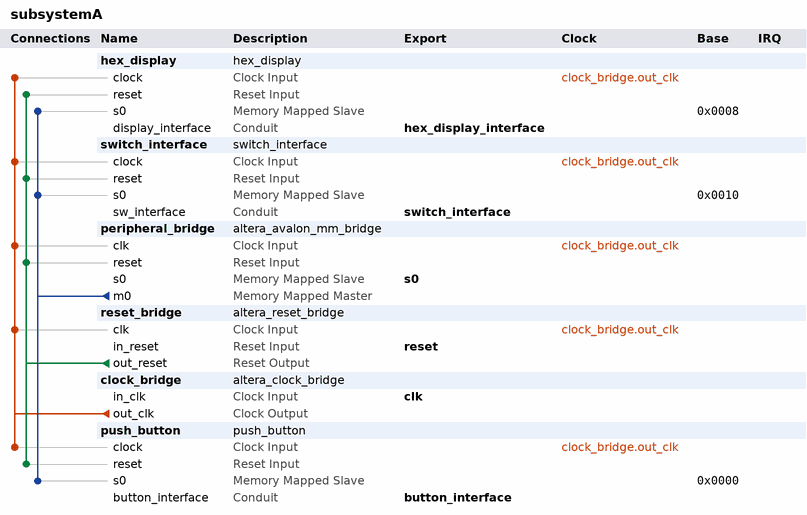
[diagram p0: system contents]
# Platform Designer (Qsys) system subsystemA, MAX 10 10M50DAF484C7G
# Parameters at their usual value, and those the tool derives, are not listed.
package require -exact qsys 18.1
create_system subsystemA
set_project_property DEVICE_FAMILY {MAX 10}
set_project_property DEVICE 10M50DAF484C7G

add_instance hex_display hex_display 1.0

add_instance switch_interface switch_interface 1.0

add_instance peripheral_bridge altera_avalon_mm_bridge 18.1
set_instance_parameter_value peripheral_bridge ADDRESS_UNITS SYMBOLS
set_instance_parameter_value peripheral_bridge ADDRESS_WIDTH 10
set_instance_parameter_value peripheral_bridge DATA_WIDTH 32
set_instance_parameter_value peripheral_bridge MAX_PENDING_RESPONSES 4
set_instance_parameter_value peripheral_bridge USE_AUTO_ADDRESS_WIDTH 0

add_instance reset_bridge altera_reset_bridge 18.1
set_instance_parameter_value reset_bridge ACTIVE_LOW_RESET 0
set_instance_parameter_value reset_bridge SYNCHRONOUS_EDGES deassert

add_instance clock_bridge altera_clock_bridge 18.1
set_instance_parameter_value clock_bridge DERIVED_CLOCK_RATE 0
set_instance_parameter_value clock_bridge EXPLICIT_CLOCK_RATE 0

add_instance push_button push_button 1.0
set_instance_parameter_value push_button DEBOUNCE_LIMIT 1000000

# connections
add_connection clock_bridge.out_clk hex_display.clock clock
add_connection clock_bridge.out_clk peripheral_bridge.clk clock
add_connection clock_bridge.out_clk push_button.clock clock
add_connection clock_bridge.out_clk reset_bridge.clk clock
add_connection clock_bridge.out_clk switch_interface.clock clock
add_connection reset_bridge.out_reset hex_display.reset reset
add_connection reset_bridge.out_reset peripheral_bridge.reset reset
add_connection reset_bridge.out_reset push_button.reset reset
add_connection reset_bridge.out_reset switch_interface.reset reset
add_connection peripheral_bridge.m0 hex_display.s0 avalon
set_connection_parameter_value peripheral_bridge.m0/hex_display.s0 baseAddress 0x0008
add_connection peripheral_bridge.m0 push_button.s0 avalon
set_connection_parameter_value peripheral_bridge.m0/push_button.s0 baseAddress 0x0000
add_connection peripheral_bridge.m0 switch_interface.s0 avalon
set_connection_parameter_value peripheral_bridge.m0/switch_interface.s0 baseAddress 0x0010

# exported interfaces
add_interface button_interface conduit end
set_interface_property button_interface EXPORT_OF push_button.button_interface
add_interface clk clock sink
set_interface_property clk EXPORT_OF clock_bridge.in_clk
add_interface hex_display_interface conduit end
set_interface_property hex_display_interface EXPORT_OF hex_display.display_interface
add_interface reset reset sink
set_interface_property reset EXPORT_OF reset_bridge.in_reset
add_interface s0 avalon slave
set_interface_property s0 EXPORT_OF peripheral_bridge.s0
add_interface switch_interface conduit end
set_interface_property switch_interface EXPORT_OF switch_interface.sw_interface

set_interconnect_requirement {$system} qsys_mm.clockCrossingAdapter HANDSHAKE
set_interconnect_requirement {$system} qsys_mm.enableEccProtection FALSE
set_interconnect_requirement {$system} qsys_mm.insertDefaultSlave FALSE
set_interconnect_requirement {$system} qsys_mm.maxAdditionalLatency 1

save_system subsystemA.qsys
